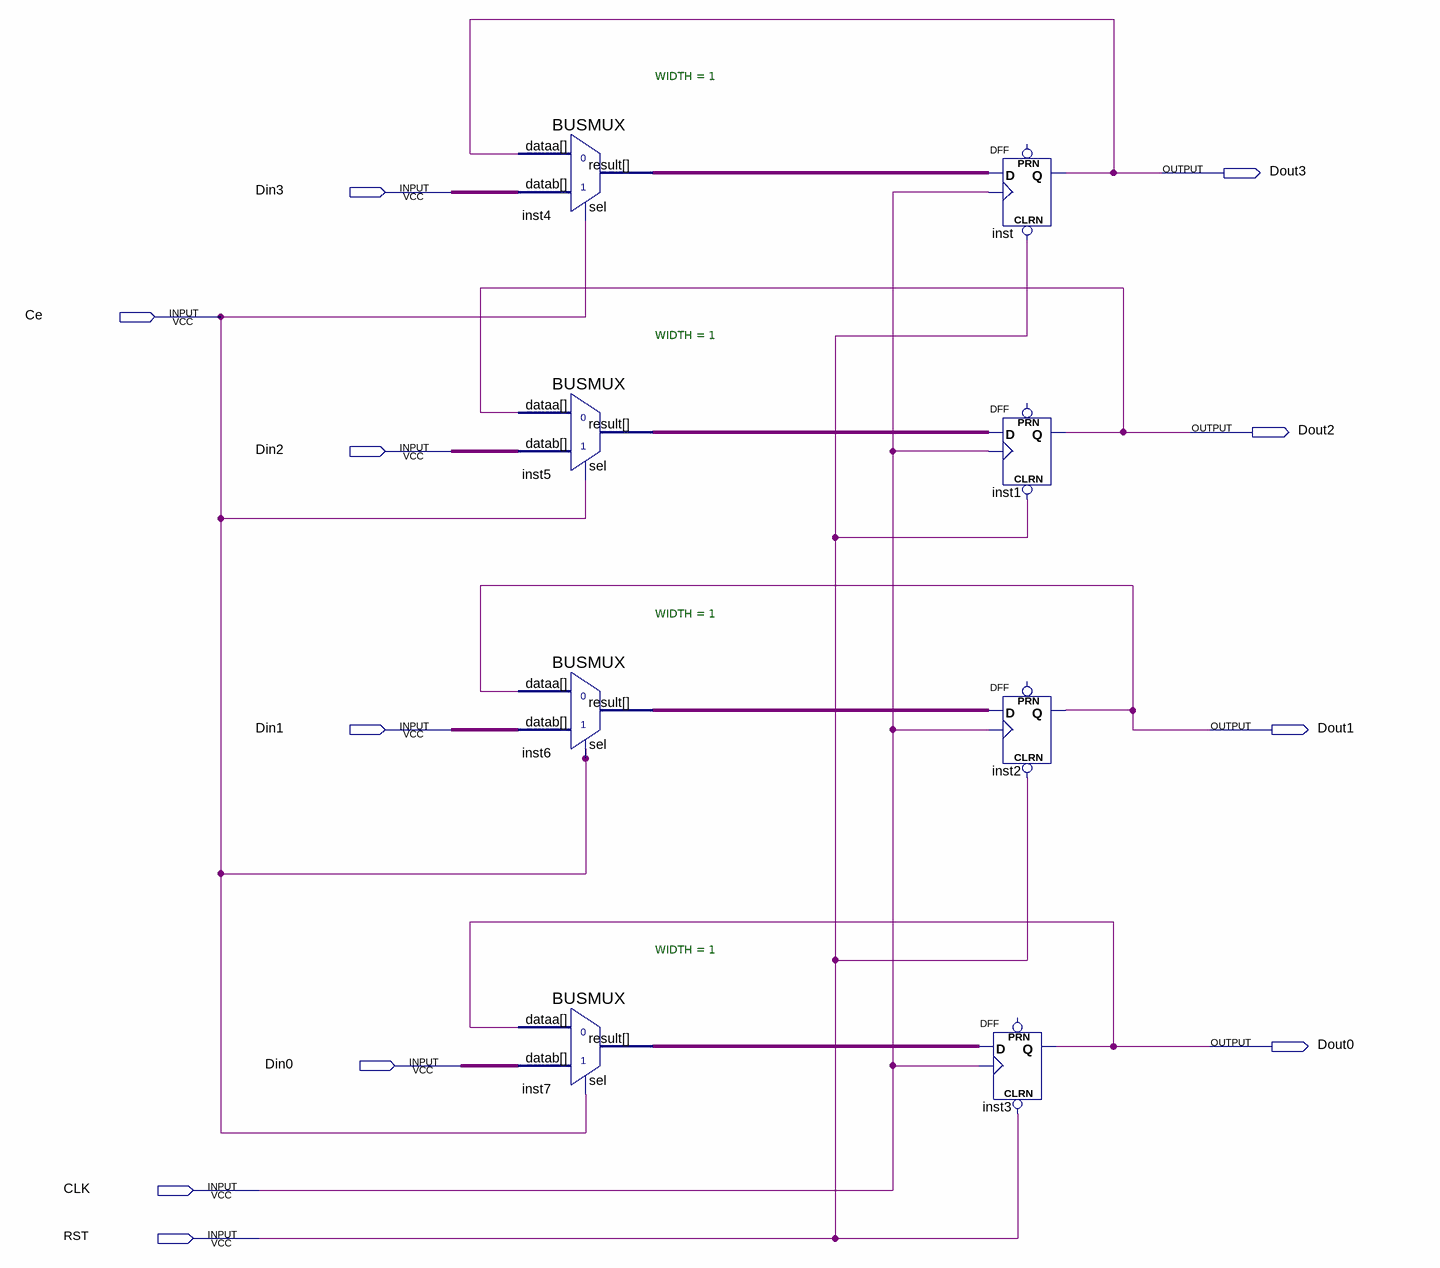
[diagram p0: schematic sheet]
// Quartus schematic week4_4.bdf as structural Verilog: 8 symbols, 11 pins
module week4_4 (
  input  Din3,
  input  Ce,
  input  Din2,
  input  Din1,
  input  Din0,
  input  CLK,
  input  RST,
  output Dout3,
  output Dout2,
  output Dout1,
  output Dout0
);

  wire inst4_result, inst5_result, inst6_result, inst7_result;

  BUSMUX #(.WIDTH(1)) inst4 (.datab(Din3), .sel(Ce), .dataa(Dout3), .result(inst4_result));
  BUSMUX #(.WIDTH(1)) inst5 (.datab(Din2), .sel(Ce), .dataa(Dout2), .result(inst5_result));
  BUSMUX #(.WIDTH(1)) inst6 (.datab(Din1), .sel(Ce), .dataa(Dout1), .result(inst6_result));
  BUSMUX #(.WIDTH(1)) inst7 (.datab(Din0), .sel(Ce), .dataa(Dout0), .result(inst7_result));
  DFF inst (.CLRN(RST), .CLK(CLK), .D(inst4_result), .Q(Dout3));  // open: PRN
  DFF inst1 (.CLRN(RST), .CLK(CLK), .D(inst5_result), .Q(Dout2));  // open: PRN
  DFF inst2 (.CLRN(RST), .CLK(CLK), .D(inst6_result), .Q(Dout1));  // open: PRN
  DFF inst3 (.CLRN(RST), .CLK(CLK), .D(inst7_result), .Q(Dout0));  // open: PRN
endmodule
